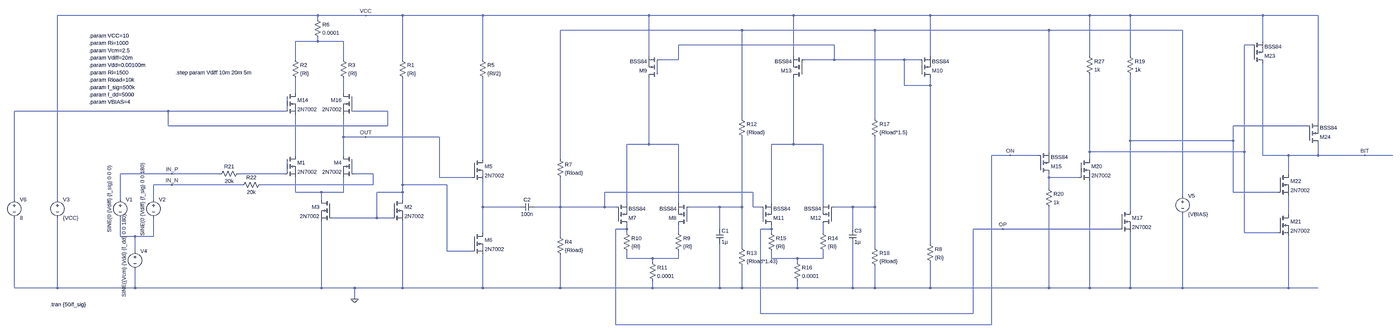
[diagram p0: schematic sense_amp.asc, whole sheet]
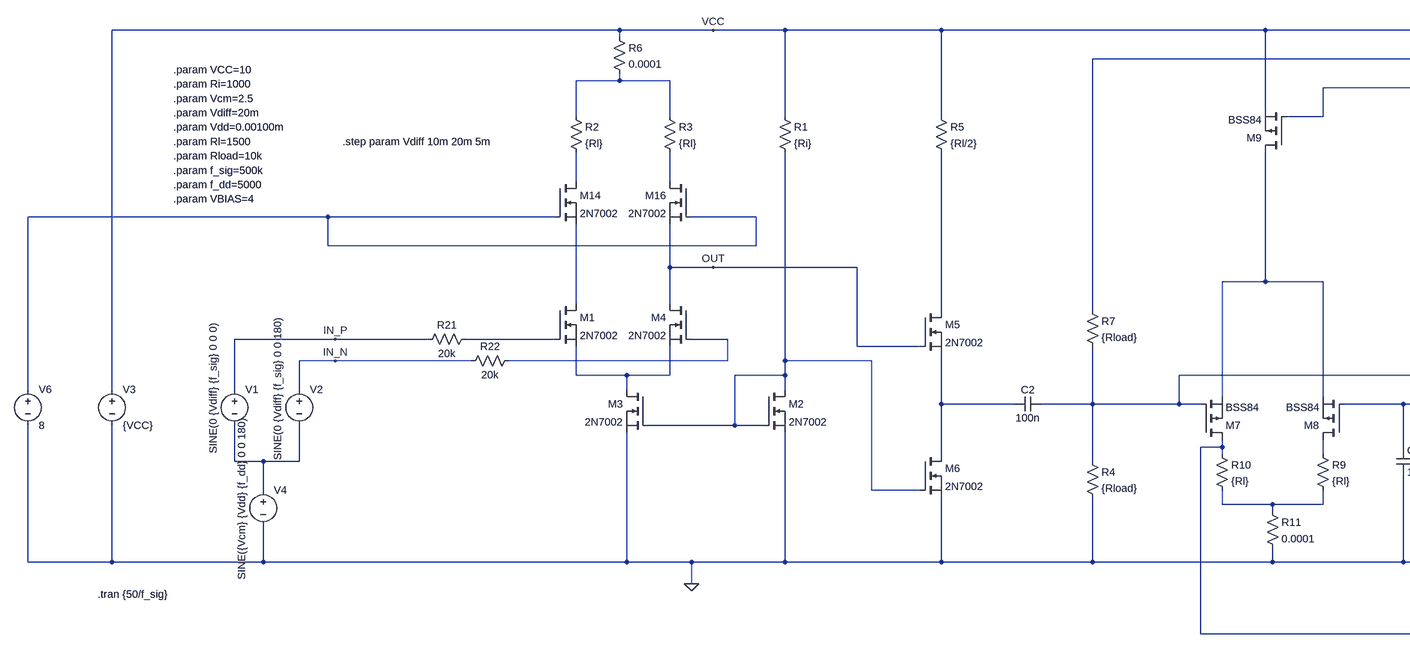
[diagram p1: schematic sense_amp.asc, part, row 1 of 1, column 1 of 2]
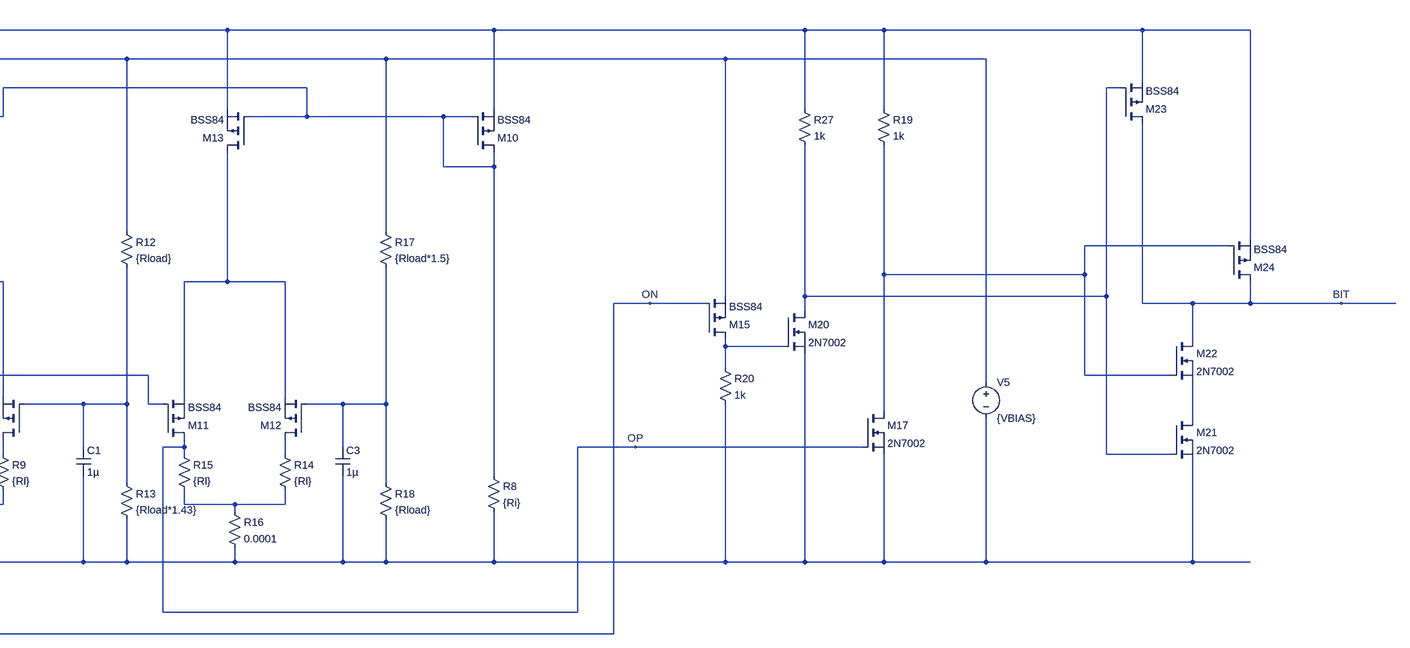
[diagram p2: schematic sense_amp.asc, part, row 1 of 1, column 2 of 2]
sense_amp.asc, the LTspice schematic file:
Version 4
SHEET 1 5492 944
WIRE 288 -464 -848 -464
WIRE 496 -464 288 -464
WIRE 656 -464 496 -464
WIRE 1040 -464 656 -464
WIRE 1760 -464 1040 -464
WIRE 2432 -464 1760 -464
WIRE 3024 -464 2432 -464
WIRE 3808 -464 3024 -464
WIRE 3984 -464 3808 -464
WIRE 4768 -464 3984 -464
WIRE 5008 -464 4768 -464
WIRE 288 -448 288 -464
WIRE 2208 -400 1376 -400
WIRE 2784 -400 2208 -400
WIRE 3632 -400 2784 -400
WIRE 4336 -400 3632 -400
WIRE 288 -352 288 -368
WIRE 288 -352 192 -352
WIRE 400 -352 288 -352
WIRE 4768 -352 4768 -464
WIRE 2608 -336 1888 -336
WIRE 4720 -336 4688 -336
WIRE 1760 -288 1760 -464
WIRE 2432 -288 2432 -464
WIRE 3024 -288 3024 -464
WIRE 3808 -288 3808 -464
WIRE 3984 -288 3984 -464
WIRE 192 -272 192 -352
WIRE 400 -272 400 -352
WIRE 656 -272 656 -464
WIRE 1040 -272 1040 -464
WIRE 1888 -272 1888 -336
WIRE 1888 -272 1808 -272
WIRE 2608 -272 2608 -336
WIRE 2608 -272 2480 -272
WIRE 2912 -272 2608 -272
WIRE 2976 -272 2912 -272
WIRE 2912 -160 2912 -272
WIRE 3024 -160 3024 -192
WIRE 3024 -160 2912 -160
WIRE 192 -128 192 -192
WIRE 400 -128 400 -192
WIRE -368 -48 -1200 -48
WIRE 144 -48 -368 -48
WIRE 592 -48 448 -48
WIRE 2208 -16 2208 -400
WIRE 2784 -16 2784 -400
WIRE 5008 0 5008 -464
WIRE -368 16 -368 -48
WIRE 592 16 592 -48
WIRE 592 16 -368 16
WIRE 4960 16 4640 16
WIRE 400 64 400 -32
WIRE 496 64 400 64
WIRE 816 64 496 64
WIRE 3984 80 3984 -208
WIRE 4640 80 4640 16
WIRE 4640 80 3984 80
WIRE 1760 96 1760 -192
WIRE 1760 96 1664 96
WIRE 1888 96 1760 96
WIRE 2432 96 2432 -192
WIRE 2432 96 2336 96
WIRE 2560 96 2432 96
WIRE 3632 128 3632 -400
WIRE 3808 128 3808 -208
WIRE 4688 128 4688 -336
WIRE 4688 128 3808 128
WIRE 192 144 192 -32
WIRE 400 144 400 64
WIRE 3392 144 3312 144
WIRE 3584 144 3392 144
WIRE 4768 144 4768 -256
WIRE 4880 144 4768 144
WIRE 5008 144 5008 96
WIRE 5008 144 4880 144
WIRE 5232 144 5008 144
WIRE 5488 144 5232 144
WIRE 1040 160 1040 -192
WIRE 1376 160 1376 -400
WIRE 3808 160 3808 128
WIRE -352 224 -576 224
WIRE -144 224 -352 224
WIRE 144 224 -64 224
WIRE 528 224 448 224
WIRE 4880 224 4880 144
WIRE 816 240 816 64
WIRE 992 240 816 240
WIRE 3632 240 3632 224
WIRE 3760 240 3632 240
WIRE -352 272 -432 272
WIRE -48 272 -352 272
WIRE 528 272 528 224
WIRE 528 272 32 272
WIRE 656 272 656 -192
WIRE 848 272 656 272
WIRE 3632 288 3632 240
WIRE 192 304 192 240
WIRE 304 304 192 304
WIRE 400 304 400 240
WIRE 400 304 304 304
WIRE 656 304 656 272
WIRE 656 304 544 304
WIRE 2256 304 1568 304
WIRE 4640 304 4640 80
WIRE 4832 304 4640 304
WIRE 4336 320 4336 -400
WIRE -1200 336 -1200 -48
WIRE -848 336 -848 -464
WIRE -576 336 -576 224
WIRE -432 336 -432 272
WIRE 304 336 304 304
WIRE 656 336 656 304
WIRE 1664 352 1664 96
WIRE 1888 352 1888 96
WIRE 2336 352 2336 96
WIRE 2560 352 2560 96
WIRE 1040 368 1040 256
WIRE 1200 368 1040 368
WIRE 1376 368 1376 240
WIRE 1376 368 1264 368
WIRE 1568 368 1568 304
WIRE 1568 368 1376 368
WIRE 1616 368 1568 368
WIRE 2112 368 1936 368
WIRE 2208 368 2208 64
WIRE 2208 368 2112 368
WIRE 2256 368 2256 304
WIRE 2288 368 2256 368
WIRE 2688 368 2608 368
WIRE 2784 368 2784 64
WIRE 2784 368 2688 368
WIRE 3984 384 3984 80
WIRE 4880 400 4880 320
WIRE 544 416 544 304
WIRE 544 416 352 416
WIRE 608 416 544 416
WIRE 1664 464 1664 448
WIRE 1664 464 1616 464
WIRE 2112 464 2112 368
WIRE 2336 464 2336 448
WIRE 2336 464 2288 464
WIRE 2688 464 2688 368
WIRE 3360 464 3232 464
WIRE 3936 464 3360 464
WIRE 1040 480 1040 368
WIRE 1664 480 1664 464
WIRE 1888 480 1888 448
WIRE 2336 480 2336 464
WIRE 2560 480 2560 448
WIRE 4688 480 4688 128
WIRE 4832 480 4688 480
WIRE -576 496 -576 416
WIRE -512 496 -576 496
WIRE -432 496 -432 416
WIRE -432 496 -512 496
WIRE 1376 496 1376 368
WIRE 3024 528 3024 -160
WIRE 2208 544 2208 368
WIRE 2784 544 2784 368
WIRE -512 560 -512 496
WIRE 848 560 848 272
WIRE 992 560 848 560
WIRE 1664 592 1664 560
WIRE 1776 592 1664 592
WIRE 1888 592 1888 560
WIRE 1888 592 1776 592
WIRE 2336 592 2336 560
WIRE 2448 592 2336 592
WIRE 2560 592 2560 560
WIRE 2560 592 2448 592
WIRE 1776 608 1776 592
WIRE 2448 608 2448 592
WIRE -1200 720 -1200 416
WIRE -848 720 -848 416
WIRE -848 720 -1200 720
WIRE -512 720 -512 640
WIRE -512 720 -848 720
WIRE 304 720 304 432
WIRE 304 720 -512 720
WIRE 448 720 304 720
WIRE 656 720 656 432
WIRE 656 720 448 720
WIRE 1040 720 1040 576
WIRE 1040 720 656 720
WIRE 1376 720 1376 576
WIRE 1376 720 1040 720
WIRE 1776 720 1776 688
WIRE 1776 720 1376 720
WIRE 2112 720 2112 528
WIRE 2112 720 1776 720
WIRE 2208 720 2208 624
WIRE 2208 720 2112 720
WIRE 2448 720 2448 688
WIRE 2448 720 2208 720
WIRE 2688 720 2688 528
WIRE 2688 720 2448 720
WIRE 2784 720 2784 624
WIRE 2784 720 2688 720
WIRE 3024 720 3024 608
WIRE 3024 720 2784 720
WIRE 3632 720 3632 368
WIRE 3632 720 3024 720
WIRE 3808 720 3808 256
WIRE 3808 720 3632 720
WIRE 3984 720 3984 480
WIRE 3984 720 3808 720
WIRE 4336 720 4336 400
WIRE 4336 720 3984 720
WIRE 4880 720 4880 496
WIRE 4880 720 4336 720
WIRE 5008 720 4880 720
WIRE 448 768 448 720
WIRE 2288 832 2288 464
WIRE 3232 832 3232 464
WIRE 3232 832 2288 832
WIRE 1616 880 1616 464
WIRE 3312 880 3312 144
WIRE 3312 880 1616 880
FLAG 496 64 OUT
FLAG 448 768 0
FLAG -352 224 IN_P
FLAG -352 272 IN_N
FLAG 496 -464 VCC
FLAG 3360 464 OP
FLAG 3392 144 ON
FLAG 5232 144 BIT
SYMBOL nmos 144 144 R0
SYMATTR InstName M1
SYMATTR Value 2N7002
SYMBOL res 640 -288 R0
SYMATTR InstName R1
SYMATTR Value {Ri}
SYMBOL nmos 608 336 R0
SYMATTR InstName M2
SYMATTR Value 2N7002
SYMBOL nmos 352 336 M0
SYMATTR InstName M3
SYMATTR Value 2N7002
SYMBOL nmos 448 144 M0
SYMATTR InstName M4
SYMATTR Value 2N7002
SYMBOL voltage -576 320 R0
WINDOW 3 -47 -133 VRight 2
WINDOW 123 0 0 Left 0
WINDOW 39 24 44 Left 2
SYMATTR Value SINE(0 {Vdiff} {f_sig} 0 0 0)
SYMATTR InstName V1
SYMBOL voltage -432 320 R0
WINDOW 3 -47 -145 VRight 2
WINDOW 123 0 0 Left 0
WINDOW 39 24 44 Left 2
SYMATTR Value SINE(0 {Vdiff} {f_sig} 0 0 180)
SYMATTR InstName V2
SYMBOL voltage -848 320 R0
WINDOW 123 0 0 Left 0
WINDOW 39 0 0 Left 0
SYMATTR InstName V3
SYMATTR Value {VCC}
SYMBOL cap 1264 352 R90
WINDOW 0 0 32 VBottom 2
WINDOW 3 32 32 VTop 2
SYMATTR InstName C2
SYMATTR Value 100n
SYMBOL voltage -512 544 R0
WINDOW 3 -47 -145 VRight 2
WINDOW 123 0 0 Left 0
WINDOW 39 0 0 Left 0
SYMATTR Value SINE({Vcm} {Vdd} {f_dd} 0 0 180)
SYMATTR InstName V4
SYMBOL res 176 -288 R0
SYMATTR InstName R2
SYMATTR Value {Rl}
SYMBOL res 384 -288 R0
SYMATTR InstName R3
SYMATTR Value {Rl}
SYMBOL res 1024 -288 R0
SYMATTR InstName R5
SYMATTR Value {Rl/2}
SYMBOL nmos 992 480 R0
SYMATTR InstName M6
SYMATTR Value 2N7002
SYMBOL res 272 -464 R0
SYMATTR InstName R6
SYMATTR Value 0.0001
SYMBOL nmos 992 160 R0
SYMATTR InstName M5
SYMATTR Value 2N7002
SYMBOL res 1360 480 R0
SYMATTR InstName R4
SYMATTR Value {Rload}
SYMBOL res 1360 144 R0
SYMATTR InstName R7
SYMATTR Value {Rload}
SYMBOL pmos 1616 448 M180
SYMATTR InstName M7
SYMATTR Value BSS84
SYMBOL pmos 1936 448 R180
SYMATTR InstName M8
SYMATTR Value BSS84
SYMBOL pmos 1808 -192 R180
SYMATTR InstName M9
SYMATTR Value BSS84
SYMBOL pmos 2976 -192 M180
SYMATTR InstName M10
SYMATTR Value BSS84
SYMBOL res 3008 512 R0
SYMATTR InstName R8
SYMATTR Value {Ri}
SYMBOL res 1872 464 R0
SYMATTR InstName R9
SYMATTR Value {Rl}
SYMBOL res 1648 464 R0
SYMATTR InstName R10
SYMATTR Value {Rl}
SYMBOL res 1760 592 R0
SYMATTR InstName R11
SYMATTR Value 0.0001
SYMBOL res 2192 -32 R0
SYMATTR InstName R12
SYMATTR Value {Rload}
SYMBOL res 2192 528 R0
SYMATTR InstName R13
SYMATTR Value {Rload*1.43}
SYMBOL cap 2096 464 R0
SYMATTR InstName C1
SYMATTR Value 1µ
SYMBOL pmos 2288 448 M180
SYMATTR InstName M11
SYMATTR Value BSS84
SYMBOL pmos 2608 448 R180
SYMATTR InstName M12
SYMATTR Value BSS84
SYMBOL pmos 2480 -192 R180
SYMATTR InstName M13
SYMATTR Value BSS84
SYMBOL res 2544 464 R0
SYMATTR InstName R14
SYMATTR Value {Rl}
SYMBOL res 2320 464 R0
SYMATTR InstName R15
SYMATTR Value {Rl}
SYMBOL res 2432 592 R0
SYMATTR InstName R16
SYMATTR Value 0.0001
SYMBOL res 2768 -32 R0
SYMATTR InstName R17
SYMATTR Value {Rload*1.5}
SYMBOL res 2768 528 R0
SYMATTR InstName R18
SYMATTR Value {Rload}
SYMBOL cap 2672 464 R0
SYMATTR InstName C3
SYMATTR Value 1µ
SYMBOL pmos 3584 224 M180
SYMATTR InstName M15
SYMATTR Value BSS84
SYMBOL res 3968 -304 R0
SYMATTR InstName R19
SYMATTR Value 1k
SYMBOL res 3616 272 R0
SYMATTR InstName R20
SYMATTR Value 1k
SYMBOL voltage 4336 304 R0
WINDOW 123 0 0 Left 0
WINDOW 39 0 0 Left 0
SYMATTR InstName V5
SYMATTR Value {VBIAS}
SYMBOL nmos 3936 384 R0
SYMATTR InstName M17
SYMATTR Value 2N7002
SYMBOL nmos 3760 160 R0
SYMATTR InstName M20
SYMATTR Value 2N7002
SYMBOL res 3792 -304 R0
SYMATTR InstName R27
SYMATTR Value 1k
SYMBOL nmos 4832 400 R0
SYMATTR InstName M21
SYMATTR Value 2N7002
SYMBOL nmos 4832 224 R0
SYMATTR InstName M22
SYMATTR Value 2N7002
SYMBOL pmos 4720 -256 M180
SYMATTR InstName M23
SYMATTR Value BSS84
SYMBOL pmos 4960 96 M180
SYMATTR InstName M24
SYMATTR Value BSS84
SYMBOL nmos 144 -128 R0
SYMATTR InstName M14
SYMATTR Value 2N7002
SYMBOL nmos 448 -128 M0
SYMATTR InstName M16
SYMATTR Value 2N7002
SYMBOL voltage -1200 320 R0
WINDOW 123 0 0 Left 0
WINDOW 39 0 0 Left 0
SYMATTR InstName V6
SYMATTR Value 8
SYMBOL res -48 208 R90
WINDOW 0 0 56 VBottom 2
WINDOW 3 32 56 VTop 2
SYMATTR InstName R21
SYMATTR Value 20k
SYMBOL res 48 256 R90
WINDOW 0 0 56 VBottom 2
WINDOW 3 32 56 VTop 2
SYMATTR InstName R22
SYMATTR Value 20k
TEXT -880 792 Left 2 !.tran {50/f_sig}
TEXT -712 -376 Left 2 !.param VCC=10
TEXT -712 -344 Left 2 !.param Ri=1000
TEXT -712 -312 Left 2 !.param Vcm=2.5
TEXT -712 -280 Left 2 !.param Vdiff=20m
TEXT -336 -216 Left 2 !.step param Vdiff 10m 20m 5m
TEXT -712 -248 Left 2 !.param Vdd=0.00100m
TEXT -712 -216 Left 2 !.param Rl=1500
TEXT -712 -184 Left 2 !.param Rload=10k
TEXT -712 -152 Left 2 !.param f_sig=500k
TEXT -712 -120 Left 2 !.param f_dd=5000
TEXT -712 -88 Left 2 !.param VBIAS=4

The netlist it stands for:
* sense_amp.asc
M1 N011 N013 N017 N017 2N7002
R1 VCC N016 {Ri}
M2 N016 N016 0 0 2N7002
M3 N017 N016 0 0 2N7002
M4 OUT N014 N017 N017 2N7002
V1 IN_P N025 SINE(0 {Vdiff} {f_sig} 0 0 0)
V2 IN_N N025 SINE(0 {Vdiff} {f_sig} 0 0 180)
V3 VCC 0 {VCC}
C2 N018 N019 100n
V4 N025 0 SINE({Vcm} {Vdd} {f_dd} 0 0 180)
R2 N002 N005 {Rl}
R3 N002 N006 {Rl}
R5 VCC N012 {Rl/2}
M6 N019 N016 0 0 2N7002
R6 VCC N002 0.0001
M5 N012 OUT N019 N019 2N7002
R4 N018 0 {Rload}
R7 N001 N018 {Rload}
M7 ON N018 N009 N009 BSS84
M8 N023 N020 N009 N009 BSS84
M9 N009 N003 VCC VCC BSS84
M10 N003 N003 VCC VCC BSS84
R8 N003 0 {Ri}
R9 N023 N026 {Rl}
R10 ON N026 {Rl}
R11 N026 0 0.0001
R12 N001 N020 {Rload}
R13 N020 0 {Rload*1.43}
C1 N020 0 1µ
M11 OP N018 N010 N010 BSS84
M12 N024 N021 N010 N010 BSS84
M13 N010 N003 VCC VCC BSS84
R14 N024 N027 {Rl}
R15 OP N027 {Rl}
R16 N027 0 0.0001
R17 N001 N021 {Rload*1.5}
R18 N021 0 {Rload}
C3 N021 0 1µ
M15 N015 ON N001 N001 BSS84
R19 VCC N008 1k
R20 N015 0 1k
V5 N001 0 {VBIAS}
M17 N008 OP 0 0 2N7002
M20 N004 N015 0 0 2N7002
R27 VCC N004 1k
M21 N022 N004 0 0 2N7002
M22 BIT N008 N022 N022 2N7002
M23 BIT N004 VCC VCC BSS84
M24 BIT N008 VCC VCC BSS84
M14 N005 N007 N011 N011 2N7002
M16 N006 N007 OUT OUT 2N7002
V6 N007 0 8
R21 N013 IN_P 20k
R22 N014 IN_N 20k
.model NMOS NMOS
.model PMOS PMOS
.lib standard.mos
.tran {50/f_sig}
.param VCC=10
.param Ri=1000
.param Vcm=2.5
.param Vdiff=20m
.step param Vdiff 10m 20m 5m
.param Vdd=0.00100m
.param Rl=1500
.param Rload=10k
.param f_sig=500k
.param f_dd=5000
.param VBIAS=4
.backanno
.end